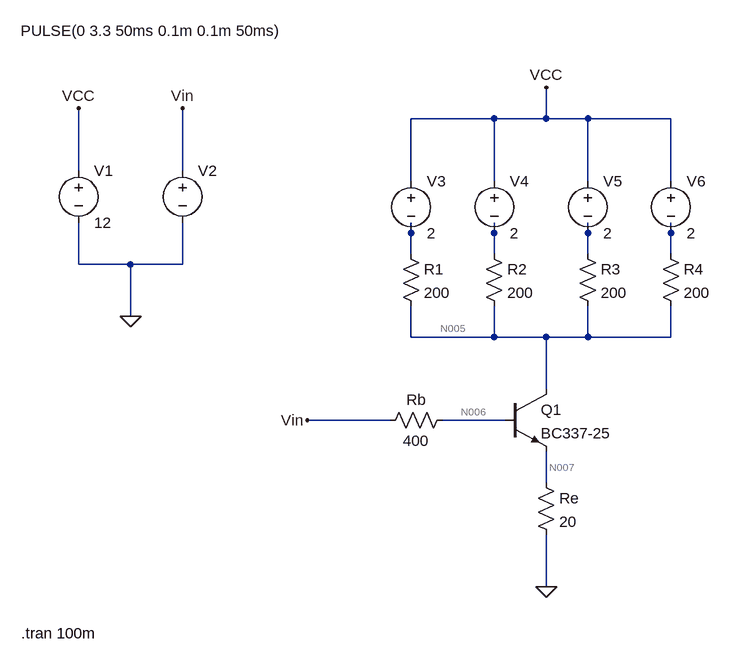
[diagram p0: schematic Draft1.asc]
Draft1.asc, the LTspice schematic file:
Version 4
SHEET 1 880 680
WIRE 368 -256 240 -256
WIRE 448 -256 448 -304
WIRE 448 -256 368 -256
WIRE 512 -256 448 -256
WIRE 640 -256 512 -256
WIRE -272 -176 -272 -272
WIRE -112 -176 -112 -272
WIRE 240 -160 240 -256
WIRE 368 -160 368 -256
WIRE 512 -160 512 -256
WIRE 640 -160 640 -256
WIRE 240 -80 240 -96
WIRE 368 -80 368 -96
WIRE 512 -80 512 -96
WIRE 640 -80 640 -96
WIRE 240 -48 240 -80
WIRE 368 -48 368 -80
WIRE 512 -48 512 -80
WIRE 640 -48 640 -80
WIRE -272 -32 -272 -96
WIRE -192 -32 -272 -32
WIRE -112 -32 -112 -96
WIRE -112 -32 -192 -32
WIRE -192 48 -192 -32
WIRE 240 80 240 32
WIRE 368 80 368 32
WIRE 368 80 240 80
WIRE 448 80 368 80
WIRE 512 80 512 32
WIRE 512 80 448 80
WIRE 640 80 640 32
WIRE 640 80 512 80
WIRE 448 160 448 80
WIRE 208 208 80 208
WIRE 384 208 288 208
WIRE 448 304 448 256
WIRE 448 464 448 384
FLAG 448 464 0
FLAG 448 -304 VCC
FLAG 80 208 Vin
FLAG -272 -272 VCC
FLAG -112 -272 Vin
FLAG -192 48 0
SYMBOL npn 384 160 R0
SYMATTR InstName Q1
SYMATTR Value BC337-25
SYMBOL res 224 -64 R0
SYMATTR InstName R1
SYMATTR Value 200
SYMBOL res 352 -64 R0
SYMATTR InstName R2
SYMATTR Value 200
SYMBOL res 496 -64 R0
SYMATTR InstName R3
SYMATTR Value 200
SYMBOL res 624 -64 R0
SYMATTR InstName R4
SYMATTR Value 200
SYMBOL res 432 288 R0
SYMATTR InstName Re
SYMATTR Value 20
SYMBOL res 304 192 R90
WINDOW 0 0 56 VBottom 2
WINDOW 3 32 56 VTop 2
SYMATTR InstName Rb
SYMATTR Value 400
SYMBOL voltage -272 -192 R0
WINDOW 123 0 0 Left 0
WINDOW 39 0 0 Left 0
SYMATTR InstName V1
SYMATTR Value 12
SYMBOL voltage -112 -192 R0
WINDOW 3 -249 -199 Left 2
WINDOW 123 0 0 Left 0
WINDOW 39 0 0 Left 0
SYMATTR Value PULSE(0 3.3 50ms 0.1m 0.1m 50ms)
SYMATTR InstName V2
SYMBOL voltage 240 -176 R0
WINDOW 123 0 0 Left 0
WINDOW 39 0 0 Left 0
SYMATTR InstName V3
SYMATTR Value 2
SYMBOL voltage 368 -176 R0
WINDOW 123 0 0 Left 0
WINDOW 39 0 0 Left 0
SYMATTR InstName V4
SYMATTR Value 2
SYMBOL voltage 512 -176 R0
WINDOW 123 0 0 Left 0
WINDOW 39 0 0 Left 0
SYMATTR InstName V5
SYMATTR Value 2
SYMBOL voltage 640 -176 R0
WINDOW 123 0 0 Left 0
WINDOW 39 0 0 Left 0
SYMATTR InstName V6
SYMATTR Value 2
TEXT -360 536 Left 2 !.tran 100m

The netlist it stands for:
* Draft1.asc
Q1 N005 N006 N007 0 BC337-25
R1 N001 N005 200
R2 N002 N005 200
R3 N003 N005 200
R4 N004 N005 200
Re N007 0 20
Rb N006 Vin 400
V1 VCC 0 12
V2 Vin 0 PULSE(0 3.3 50ms 0.1m 0.1m 50ms)
V3 VCC N001 2
V4 VCC N002 2
V5 VCC N003 2
V6 VCC N004 2
.model NPN NPN
.model PNP PNP
.lib standard.bjt
.tran 100m
.backanno
.end

* Results of the author's LTspice run, read from the files saved beside the schematic
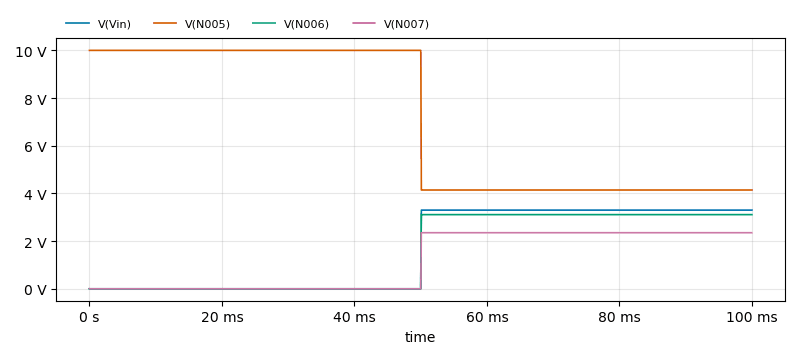
[diagram p1: Transient Analysis of Draft1.asc, plotted from the saved traces]
* Transient Analysis, 1 run:
*   V(Vin): min 0 V, max 3.3 V, average 1.648 V, rms 2.332 V, last 3.3 V
*   V(N005): min 4.143 V, max 10 V, average 7.075 V, rms 7.657 V, last 4.143 V
*   V(N006): min 0 V, max 3.111 V, average 1.554 V, rms 2.198 V, last 3.111 V
*   V(N007): min 0 V, max 2.352 V, average 1.175 V, rms 1.662 V, last 2.352 V